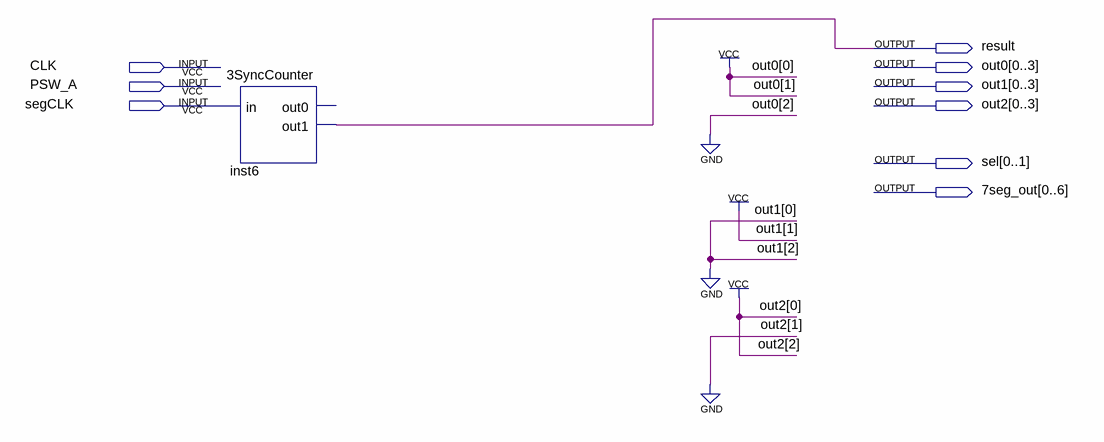
[diagram p0: schematic sheet]
// Quartus schematic DummyRandomNumber.bdf as structural Verilog: 1 symbols, 9 pins
module DummyRandomNumber (
  input  CLK,
  input  PSW_A,
  input  segCLK,
  output result,
  output [0:3] out0,
  output [0:3] out1,
  output [0:3] out2,
  output [0:1] sel,
  output [0:6] \7seg_out 
);

  \3SyncCounter  inst6 (.in(segCLK), .out1(result));  // open: out0

  assign out0[0:2] = 3'b110;
  assign out1[0:2] = 3'b010;
  assign out2[0:2] = 3'b101;
endmodule
